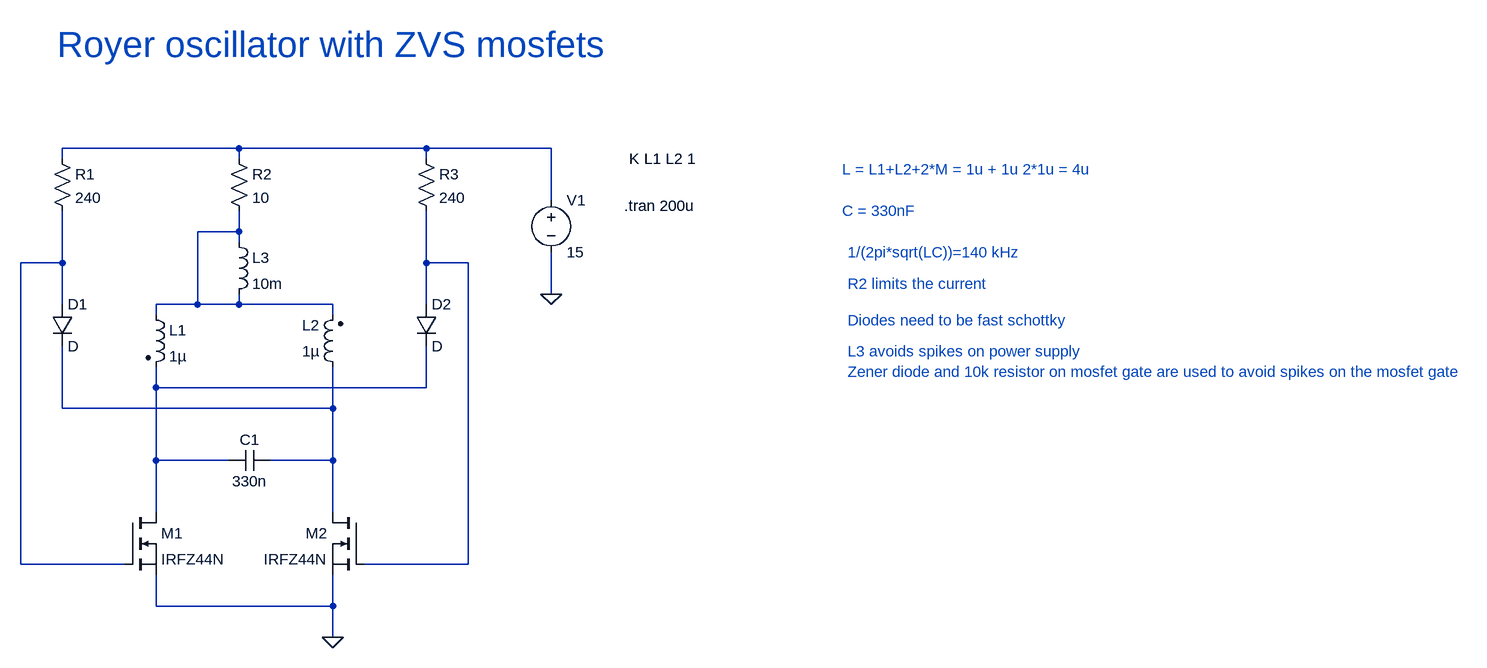
[diagram p0: schematic Royer-zvs.asc]
Royer-zvs.asc, the LTspice schematic file:
Version 4.1
SHEET 1 2304 788
WIRE 272 16 0 16
WIRE 560 16 272 16
WIRE 752 16 560 16
WIRE 0 32 0 16
WIRE 272 32 272 16
WIRE 560 32 560 16
WIRE 752 96 752 16
WIRE 272 144 272 112
WIRE 272 144 208 144
WIRE 272 160 272 144
WIRE 0 192 0 112
WIRE 0 192 -64 192
WIRE 560 192 560 112
WIRE 624 192 560 192
WIRE 752 240 752 176
WIRE 0 256 0 192
WIRE 208 256 208 144
WIRE 208 256 144 256
WIRE 272 256 272 240
WIRE 272 256 208 256
WIRE 416 256 272 256
WIRE 560 256 560 192
WIRE 144 272 144 256
WIRE 416 272 416 256
WIRE 144 384 144 352
WIRE 560 384 560 320
WIRE 560 384 144 384
WIRE 0 416 0 320
WIRE 416 416 416 352
WIRE 416 416 0 416
WIRE 144 496 144 384
WIRE 256 496 144 496
WIRE 416 496 416 416
WIRE 416 496 320 496
WIRE 144 576 144 496
WIRE 416 576 416 496
WIRE -64 656 -64 192
WIRE 96 656 -64 656
WIRE 624 656 624 192
WIRE 624 656 464 656
WIRE 144 720 144 672
WIRE 416 720 416 672
WIRE 416 720 144 720
WIRE 416 768 416 720
FLAG 416 768 0
FLAG 752 240 0
SYMBOL res -16 16 R0
SYMATTR InstName R1
SYMATTR Value 240
SYMBOL res 256 16 R0
SYMATTR InstName R2
SYMATTR Value 10
SYMBOL res 544 16 R0
SYMATTR InstName R3
SYMATTR Value 240
SYMBOL ind2 128 256 R0
SYMATTR InstName L1
SYMATTR Value 1µ
SYMATTR Type ind
SYMBOL ind2 432 368 R180
WINDOW 0 36 80 Left 2
WINDOW 3 36 40 Left 2
SYMATTR InstName L2
SYMATTR Value 1µ
SYMATTR Type ind
SYMBOL ind 256 144 R0
SYMATTR InstName L3
SYMATTR Value 10m
SYMBOL cap 320 480 R90
WINDOW 0 0 32 VBottom 2
WINDOW 3 32 32 VTop 2
SYMATTR InstName C1
SYMATTR Value 330n
SYMBOL diode -16 256 R0
SYMATTR InstName D1
SYMBOL diode 544 256 R0
SYMATTR InstName D2
SYMBOL nmos 96 576 R0
SYMATTR InstName M1
SYMATTR Value IRFZ44N
SYMBOL nmos 464 576 M0
SYMATTR InstName M2
SYMATTR Value IRFZ44N
SYMBOL voltage 752 80 R0
WINDOW 123 0 0 Left 0
WINDOW 39 0 0 Left 0
SYMATTR InstName V1
SYMATTR Value 15
TEXT 864 104 Left 2 !.tran 200u
TEXT 872 32 Left 2 !K L1 L2 1
TEXT 1200 48 Left 2 ;L = L1+L2+2*M = 1u + 1u 2*1u = 4u
TEXT 1200 112 Left 2 ;C = 330nF
TEXT 1208 176 Left 2 ;1/(2pi*sqrt(LC))=140 kHz
TEXT 1208 224 Left 2 ;R2 limits the current
TEXT -8 -144 Left 5 ;Royer oscillator with ZVS mosfets
TEXT 1208 280 Left 2 ;Diodes need to be fast schottky
TEXT 1208 328 Left 2 ;L3 avoids spikes on power supply\nZener diode and 10k resistor on mosfet gate are used to avoid spikes on the mosfet gate

The netlist it stands for:
* Royer-zvs.asc
R1 N001 N003 240
R2 N001 N002 10
R3 N001 N004 240
L1 N002 N005 1µ
L2 N006 N002 1µ
L3 N002 N002 10m
C1 N006 N005 330n
D1 N003 N006 D
D2 N004 N005 D
M1 N005 N003 0 0 IRFZ44N
M2 N006 N004 0 0 IRFZ44N
V1 N001 0 15
.model D D
.lib standard.dio
.model NMOS NMOS
.model PMOS PMOS
.lib standard.mos
.tran 200u
K L1 L2 1
* L = L1+L2+2*M = 1u + 1u 2*1u = 4u
* C = 330nF
* 1/(2pi*sqrt(LC))=140 kHz
* R2 limits the current
* Royer oscillator with ZVS mosfets
* Diodes need to be fast schottky
* L3 avoids spikes on power supply
* Zener diode and 10k resistor on mosfet gate are used to avoid spikes on the mosfet gate
.backanno
.end